# Altium project Big seven-segment display.PrjPcb
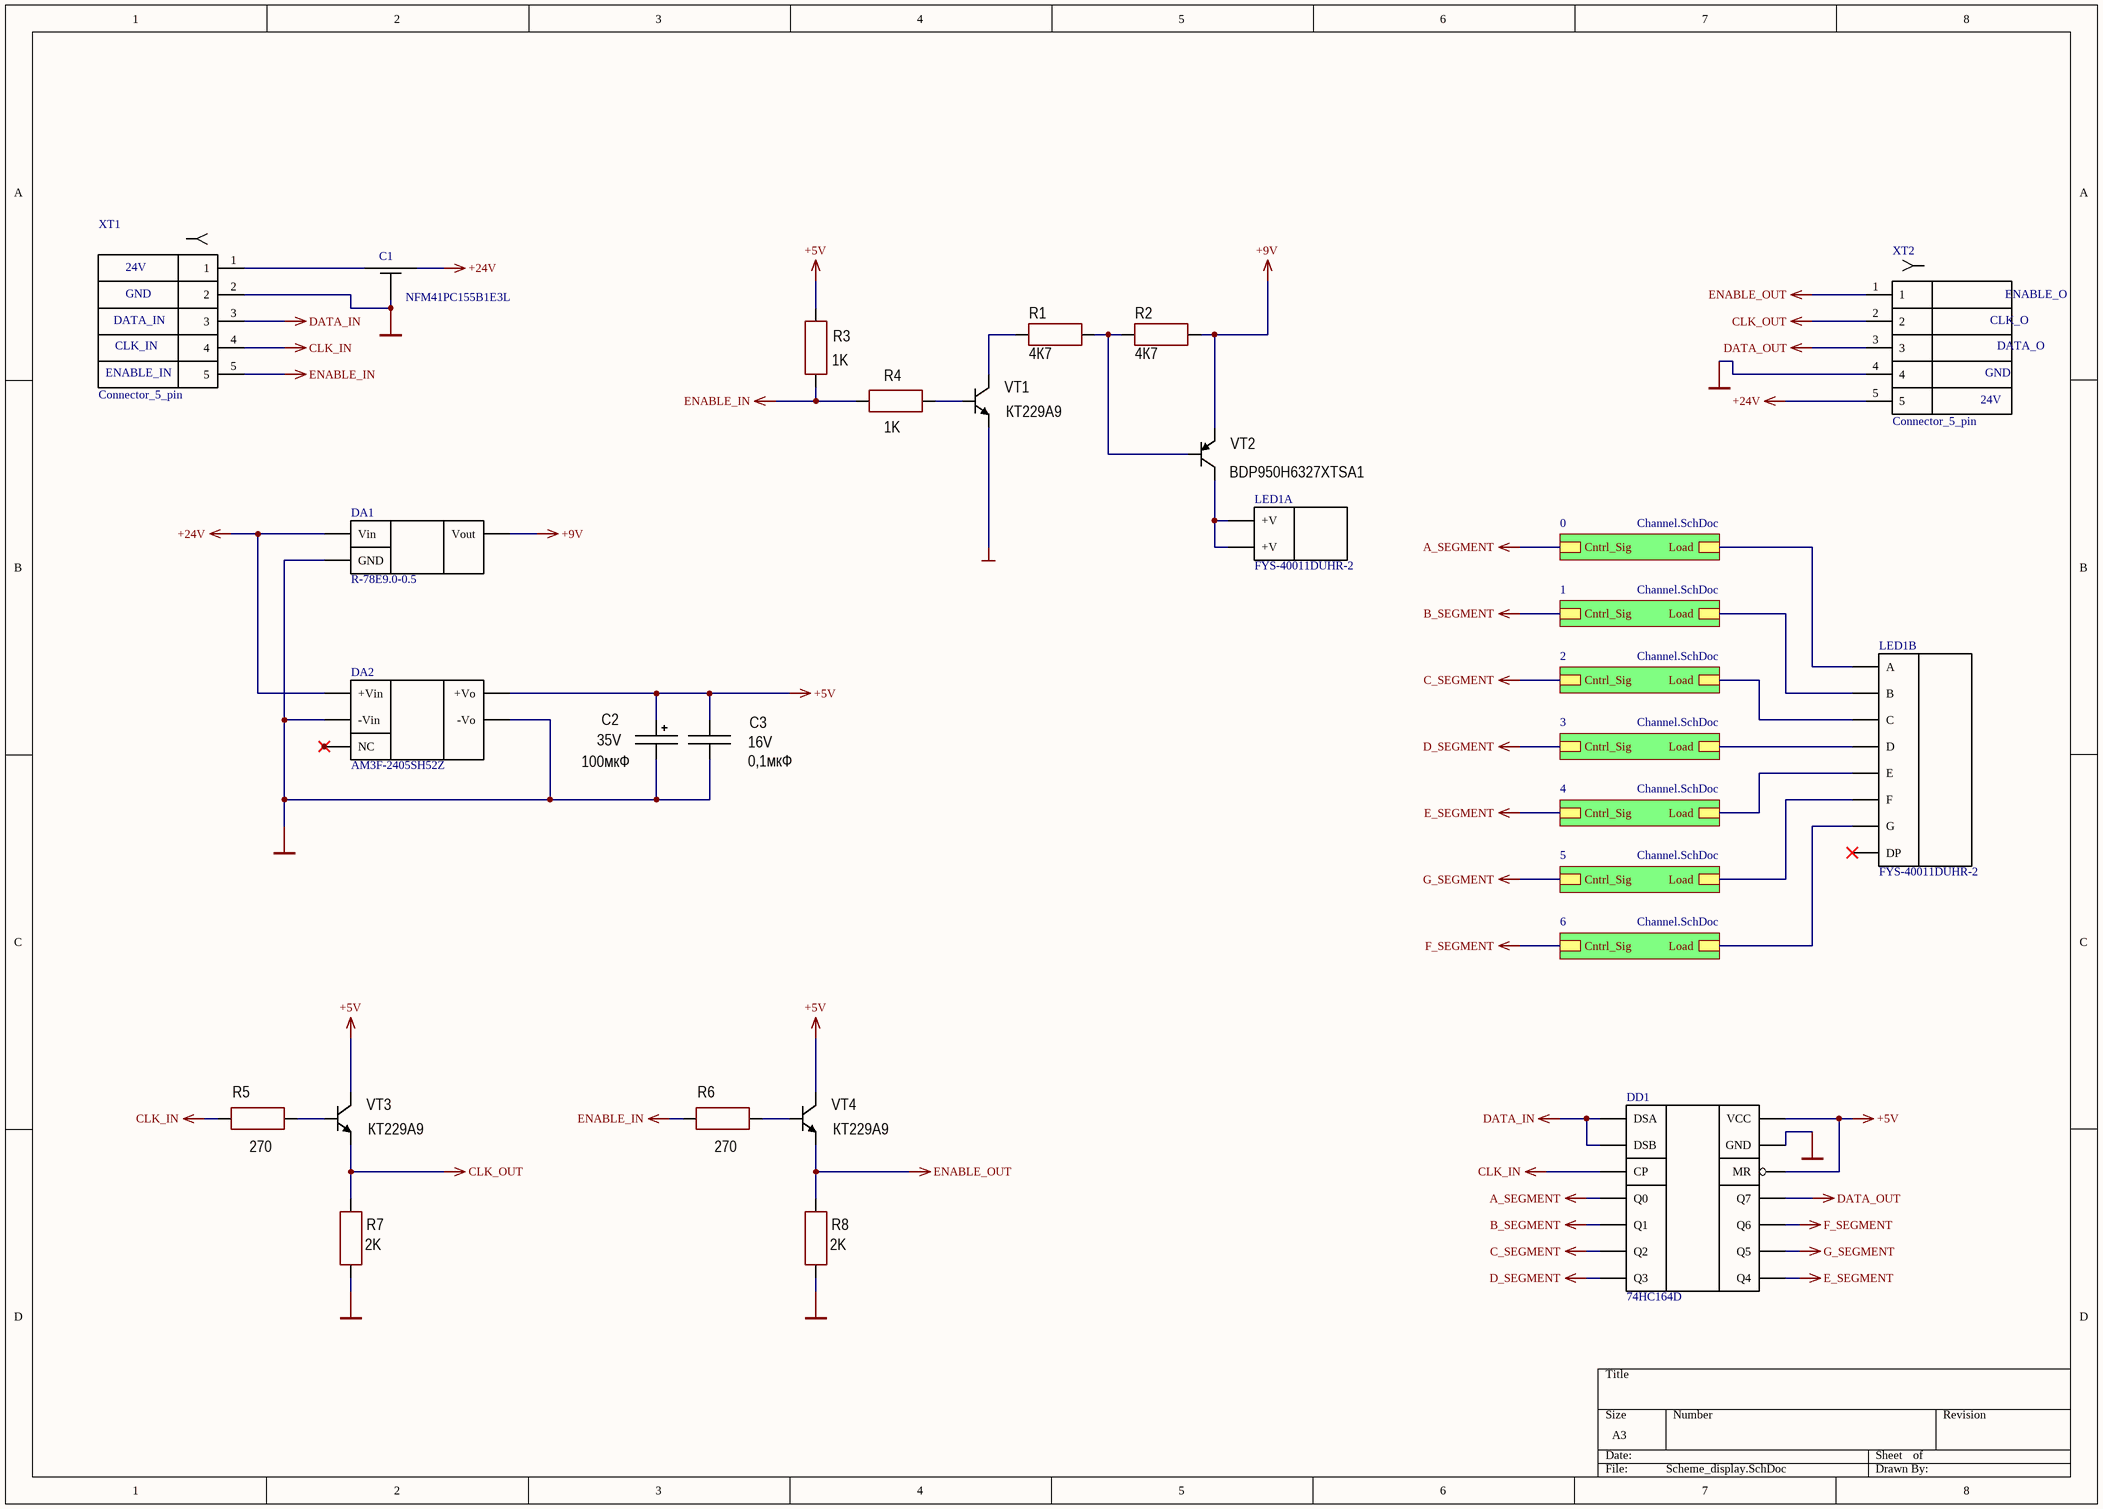
[diagram p0: Scheme_display.SchDoc]
2 sheets, 42 parts. Net scope: hierarchical (ports join the sheet entries above them; power ports are global).
Board file: PCB_v1.PcbDoc
Sheets:
  Scheme_display.SchDoc
    0 = Channel.SchDoc
    1 = Channel.SchDoc
    2 = Channel.SchDoc
    3 = Channel.SchDoc
    4 = Channel.SchDoc
    5 = Channel.SchDoc
    6 = Channel.SchDoc

## Sheet Scheme_display.SchDoc
size A3; SheetNumber: 1; SheetTotal: 2

### Parts
C1  NFM41PC155B1E3L  [NFM41PC155B1E3L]
C2  value 100мкФ  Voltage: 35V  [CAP: D6.3C2.5H16]
C3  value 0,1мкФ  Voltage: 16V  [CAP: 0805]
DA1  R-78E9.0-0.5  [R-78E9.0-0.5]
DA2  AM3F-2405SH52Z  [AM3F-2405SH52Z]
DD1  74HC164D  [14-SOIC]
LED1  FYS-40011DUHR-2  [FYS-40011DUHR-2]  (parts A,B of 2)
R1  value 4К7  [RES: 0805]
R2  value 4К7  [RES: 0805]
R3  value 1K  [RES: 0805]
R4  value 1K  [RES: 0805]
R5  value 270  [RES: 0805]
R6  value 270  [RES: 0805]
R7  value 2K  [RES: 0805]
R8  value 2K  [RES: 0805]
VT1  PartNumber: КТ229А9  [SOT23]
VT2  PartNumber: BDP950H6327XTSA1  [SOT223]
VT3  PartNumber: КТ229А9  [SOT23]
VT4  PartNumber: КТ229А9  [SOT23]
XT1  Connector_5_pin  [Connector_5-pin]
XT2  Connector_5_pin  [Connector_5-pin]

### Sub-sheets
0 = Channel.SchDoc: Cntrl_Sig, Load
1 = Channel.SchDoc: Cntrl_Sig, Load
2 = Channel.SchDoc: Cntrl_Sig, Load
3 = Channel.SchDoc: Cntrl_Sig, Load
4 = Channel.SchDoc: Cntrl_Sig, Load
5 = Channel.SchDoc: Cntrl_Sig, Load
6 = Channel.SchDoc: Cntrl_Sig, Load

### Nets
+5V: C2.1 C3.2 DA2.11(+Vo) DD1.9(MR) DD1.14(VCC) R3.2 VT3.3(C) VT4.3(C)
+9V: DA1.3(Vout) R2.1 VT2.3(E)
+24V: C1.2 DA1.1(Vin) DA2.1(+Vin) XT2.5
A_SEGMENT: DD1.3(Q0) ; sheet 0/Cntrl_Sig
B_SEGMENT: DD1.4(Q1) ; sheet 1/Cntrl_Sig
C_SEGMENT: DD1.5(Q2) ; sheet 2/Cntrl_Sig
CLK_IN: DD1.8(CP) R5.1 XT1.4
CLK_OUT: R7.2 VT3.2(E) XT2.2
D_SEGMENT: DD1.6(Q3) ; sheet 3/Cntrl_Sig
DATA_IN: DD1.1(DSA) DD1.2(DSB) XT1.3
DATA_OUT: DD1.13(Q7) XT2.3
E_SEGMENT: DD1.10(Q4) ; sheet 4/Cntrl_Sig
ENABLE_IN: R3.1 R4.1 R6.1 XT1.5
ENABLE_OUT: R8.2 VT4.2(E) XT2.1
F_SEGMENT: DD1.12(Q6) ; sheet 6/Cntrl_Sig
G_SEGMENT: DD1.11(Q5) ; sheet 5/Cntrl_Sig
GND: C1.3(GND) C2.2 C3.1 DA1.2(GND) DA2.10(-Vo) DA2.12(-Vin) DD1.7(GND) R7.1 R8.1 VT1.2(E) XT1.2 XT2.4
NetC1_1: C1.1 XT1.1
NetDA2_2: DA2.2(NC) DA2.3(NC) DA2.9(NC)
NetLED1_1: LED1.1(E) ; sheet 4/Load
NetLED1_2: LED1.2(D) ; sheet 3/Load
NetLED1_3: LED1.3(+V) LED1.8(+V) VT2.2(C)
NetLED1_4: LED1.4(C) ; sheet 2/Load
NetLED1_6: LED1.6(B) ; sheet 1/Load
NetLED1_7: LED1.7(A) ; sheet 0/Load
NetLED1_9: LED1.9(F) ; sheet 5/Load
NetLED1_10: LED1.10(G) ; sheet 6/Load
NetR1_1: R1.1 R2.2 VT2.1(B)
NetR1_2: R1.2 VT1.3(C)
NetR4_2: R4.2 VT1.1(B)
NetR5_2: R5.2 VT3.1(B)
NetR6_2: R6.2 VT4.1(B)

Not connected (* = marked no-connect by the designer): LED1 5(DP)*

### Notes on the sheet
- 24V
- GND
- ENABLE_O
- ENABLE_IN
- DATA_IN
- CLK_IN
- CLK_O
- DATA_O

### Library data of the parts
C1 = NFM41PC155B1E3L: Керамический фильтр SMD 1812
C2 = Aluminium: Manufacturer: Wurth; PartNumber: 860080475013; ValueManufacturerPartNumber: Aluminium capacitor, 100мкФ, 35V, ±20%, 54mOhm, 14x10x5 mm, -55...+105°C; TypeCapacitor: Aluminium capacitor; Tolerance: ±20%; Impedance: 54mOhm; Package: 14x10x5 mm; HelpURL: https://www.digikey.com/product-detail/en/wurth-electronics-inc/860080475013/732-9029-1-ND/5728972; Temperature: -55...+105°C
C3 = Ceramic_0805: Manufacturer: Yageo; PartNumber: CC0805KRX7R7BB104; ValueManufacturerPartNumber: Ceramic capacitor, 0,1мкФ, X7R, ±10%, 16V, 0805, -55...+125°C; TypeCapacitor: Ceramic capacitor; Tolerance: ±10%; TypeDielectric: X7R; Package: 0805; HelpURL: https://www.digikey.com/product-detail/en/yageo/CC0805KRX7R7BB104/311-1142-1-ND/303052; Temperature: -55...+125°C
DA1 = R-78E9.0-0.5: DC/DC преобразователь, вход 12-28В, выход 9В/500мА
DA2 = AM3F-2405SH52Z: DC/DC преобразователь, 3Вт, вход 21.6…26.4В, выход 5В/600мА
DD1 = 74HC164D: Сдвиговый регистр с push-pull выходом
LED1 = FYS-40011DUHR-2: БОЛЬШОЙ 7- сегментный индикатор
R1 R2 = Resistor_0805: Manufacturer: Yageo; PartNumber: RC0805JR-07100RL; ValueManufacturerPartNumber: Resistor film, 4К7, ±5%, 0805, 0.125W, -55...+125°C; TypeResistor: Resistor film; Power: 0.125W; Tolerance: ±5%; Package: 0805; HelpURL: https://www.digikey.com/product-detail/en/yageo/RC0805JR-07100RL/311-100ARCT-ND/731185; Temperature: -55...+125°C
R3 R4 = Resistor_0805: Manufacturer: Yageo; PartNumber: RC0805JR-07100RL; ValueManufacturerPartNumber: Resistor film, 1K, ±5%, 0805, 0.125W, -55...+125°C; TypeResistor: Resistor film; Power: 0.125W; Tolerance: ±5%; Package: 0805; HelpURL: https://www.digikey.com/product-detail/en/yageo/RC0805JR-07100RL/311-100ARCT-ND/731185; Temperature: -55...+125°C
R5 R6 = Resistor_0805: Manufacturer: Yageo; PartNumber: RC0805JR-07100RL; ValueManufacturerPartNumber: Resistor film, 270, ±5%, 0805, 0.125W, -55...+125°C; TypeResistor: Resistor film; Power: 0.125W; Tolerance: ±5%; Package: 0805; HelpURL: https://www.digikey.com/product-detail/en/yageo/RC0805JR-07100RL/311-100ARCT-ND/731185; Temperature: -55...+125°C
R7 R8 = Resistor_0805: Manufacturer: Yageo; PartNumber: RC0805JR-07100RL; ValueManufacturerPartNumber: Resistor film, 2K, ±5%, 0805, 0.125W, -55...+125°C; TypeResistor: Resistor film; Power: 0.125W; Tolerance: ±5%; Package: 0805; HelpURL: https://www.digikey.com/product-detail/en/yageo/RC0805JR-07100RL/311-100ARCT-ND/731185; Temperature: -55...+125°C
VT1 VT3 VT4 = BJT_NPN_132: Manufacturer: ON Semiconductor; ValueManufacturerPartNumber: NPN transistor, 45V, 100mA, 100MHz, 300mW, 0.6V, 420, SOT-23, -55...+125°C; TypeTransistor: NPN transistor; VoltageCE: 45V; CurrentCE: 100mA; VoltageSaturation: 0.6V; Frequency: 100MHz; CurrentGain: 420; MaxPower: 300mW; Package: SOT-23; HelpURL: https://www.digikey.com/product-detail/en/on-semiconductor/BC847CLT1G/BC847CLT1GOSCT-ND/917836; Temperature: -55...+125°C
VT2 = BJT_PNP_132: Manufacturer: ON Semiconductor; ValueManufacturerPartNumber: PNP transistor, 45V, 100mA, 100MHz, 300mW, 0.65V, 220, SOT-23, -55...+125°C; TypeTransistor: PNP transistor; VoltageCE: 45V; CurrentCE: 100mA; VoltageSaturation: 0.65V; Frequency: 100MHz; CurrentGain: 220; MaxPower: 300mW; Package: SOT-23; HelpURL: https://www.digikey.com/product-detail/en/on-semiconductor/BC857BLT3G/BC857BLT3GOSCT-ND/2704963; Temperature: -55...+125°C

## Sheet Channel.SchDoc
size A4; SheetNumber: 2; SheetTotal: 2
Used 7 times, as channels 0, 1, 2, 3, 4, 5, 6. Parts and nets are listed once, with the designators drawn on the sheet.
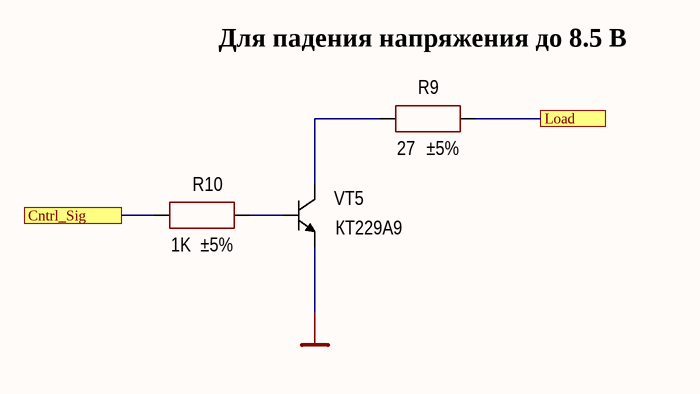
[diagram p1: Channel.SchDoc]

### Parts
R9  value 27  Tolerance: ±5%  [RES: 0805]
R10  value 1K  Tolerance: ±5%  [RES: 0805]
VT5  PartNumber: КТ229А9  [SOT23]

### Ports
Cntrl_Sig, Load

### Nets
GND: VT5.2(E)
Cntrl_Sig: R10.1 ; port Cntrl_Sig
Load: R9.2 ; port Load
NetR9_1: R9.1 VT5.3(C)
NetR10_2: R10.2 VT5.1(B)

### Channels
0: designators end in _0; ports Cntrl_Sig=A_SEGMENT Load=NetLED1_7
1: designators end in _1; ports Cntrl_Sig=B_SEGMENT Load=NetLED1_6
2: designators end in _2; ports Cntrl_Sig=C_SEGMENT Load=NetLED1_4
3: designators end in _3; ports Cntrl_Sig=D_SEGMENT Load=NetLED1_2
4: designators end in _4; ports Cntrl_Sig=E_SEGMENT Load=NetLED1_1
5: designators end in _5; ports Cntrl_Sig=G_SEGMENT Load=NetLED1_9
6: designators end in _6; ports Cntrl_Sig=F_SEGMENT Load=NetLED1_10

### Notes on the sheet
- (near R9) Для падения напряжения до 8.5 В

### Library data of the parts
R9 = Resistor_0805: Manufacturer: Yageo; PartNumber: RC0805JR-07100RL; ValueManufacturerPartNumber: Resistor film, 27, ±5%, 0805, 0.125W, -55...+125°C; TypeResistor: Resistor film; Power: 0.125W; Package: 0805; HelpURL: https://www.digikey.com/product-detail/en/yageo/RC0805JR-07100RL/311-100ARCT-ND/731185; Temperature: -55...+125°C
R10 = Resistor_0805: Manufacturer: Yageo; PartNumber: RC0805JR-07100RL; ValueManufacturerPartNumber: Resistor film, 1K, ±5%, 0805, 0.125W, -55...+125°C; TypeResistor: Resistor film; Power: 0.125W; Package: 0805; HelpURL: https://www.digikey.com/product-detail/en/yageo/RC0805JR-07100RL/311-100ARCT-ND/731185; Temperature: -55...+125°C
VT5 = BJT_NPN_132: as VT1 on sheet Scheme_display; Package: SOT-23; HelpURL: https://www.digikey.com/product-detail/en/on-semiconductor/BC847CLT1G/BC847CLT1GOSCT-ND/917836; Temperature: -55...+125°C

## Nets that join several sheets
A_SEGMENT: Scheme_display (DD1.3), 0 (R10_0.1)
B_SEGMENT: Scheme_display (DD1.4), 1 (R10_1.1)
C_SEGMENT: Scheme_display (DD1.5), 2 (R10_2.1)
D_SEGMENT: Scheme_display (DD1.6), 3 (R10_3.1)
E_SEGMENT: Scheme_display (DD1.10), 4 (R10_4.1)
F_SEGMENT: Scheme_display (DD1.12), 6 (R10_6.1)
G_SEGMENT: Scheme_display (DD1.11), 5 (R10_5.1)
GND: Scheme_display (12 pins), 0 (VT5_0.2), 1 (VT5_1.2), 2 (VT5_2.2), 3 (VT5_3.2), 4 (VT5_4.2), 5 (VT5_5.2), 6 (VT5_6.2)
NetLED1_1: Scheme_display (LED1.1), 4 (R9_4.2)
NetLED1_2: Scheme_display (LED1.2), 3 (R9_3.2)
NetLED1_4: Scheme_display (LED1.4), 2 (R9_2.2)
NetLED1_6: Scheme_display (LED1.6), 1 (R9_1.2)
NetLED1_7: Scheme_display (LED1.7), 0 (R9_0.2)
NetLED1_9: Scheme_display (LED1.9), 5 (R9_5.2)
NetLED1_10: Scheme_display (LED1.10), 6 (R9_6.2)